# EAGLE design lamloei_node32s3wroom_cp2102_msmd_4layers (EAGLE 7.7.0)
CNAME: LamLoei Node32S3Wroom; CREVISION: R1; DESIGNER: lamloei co.,ltd.
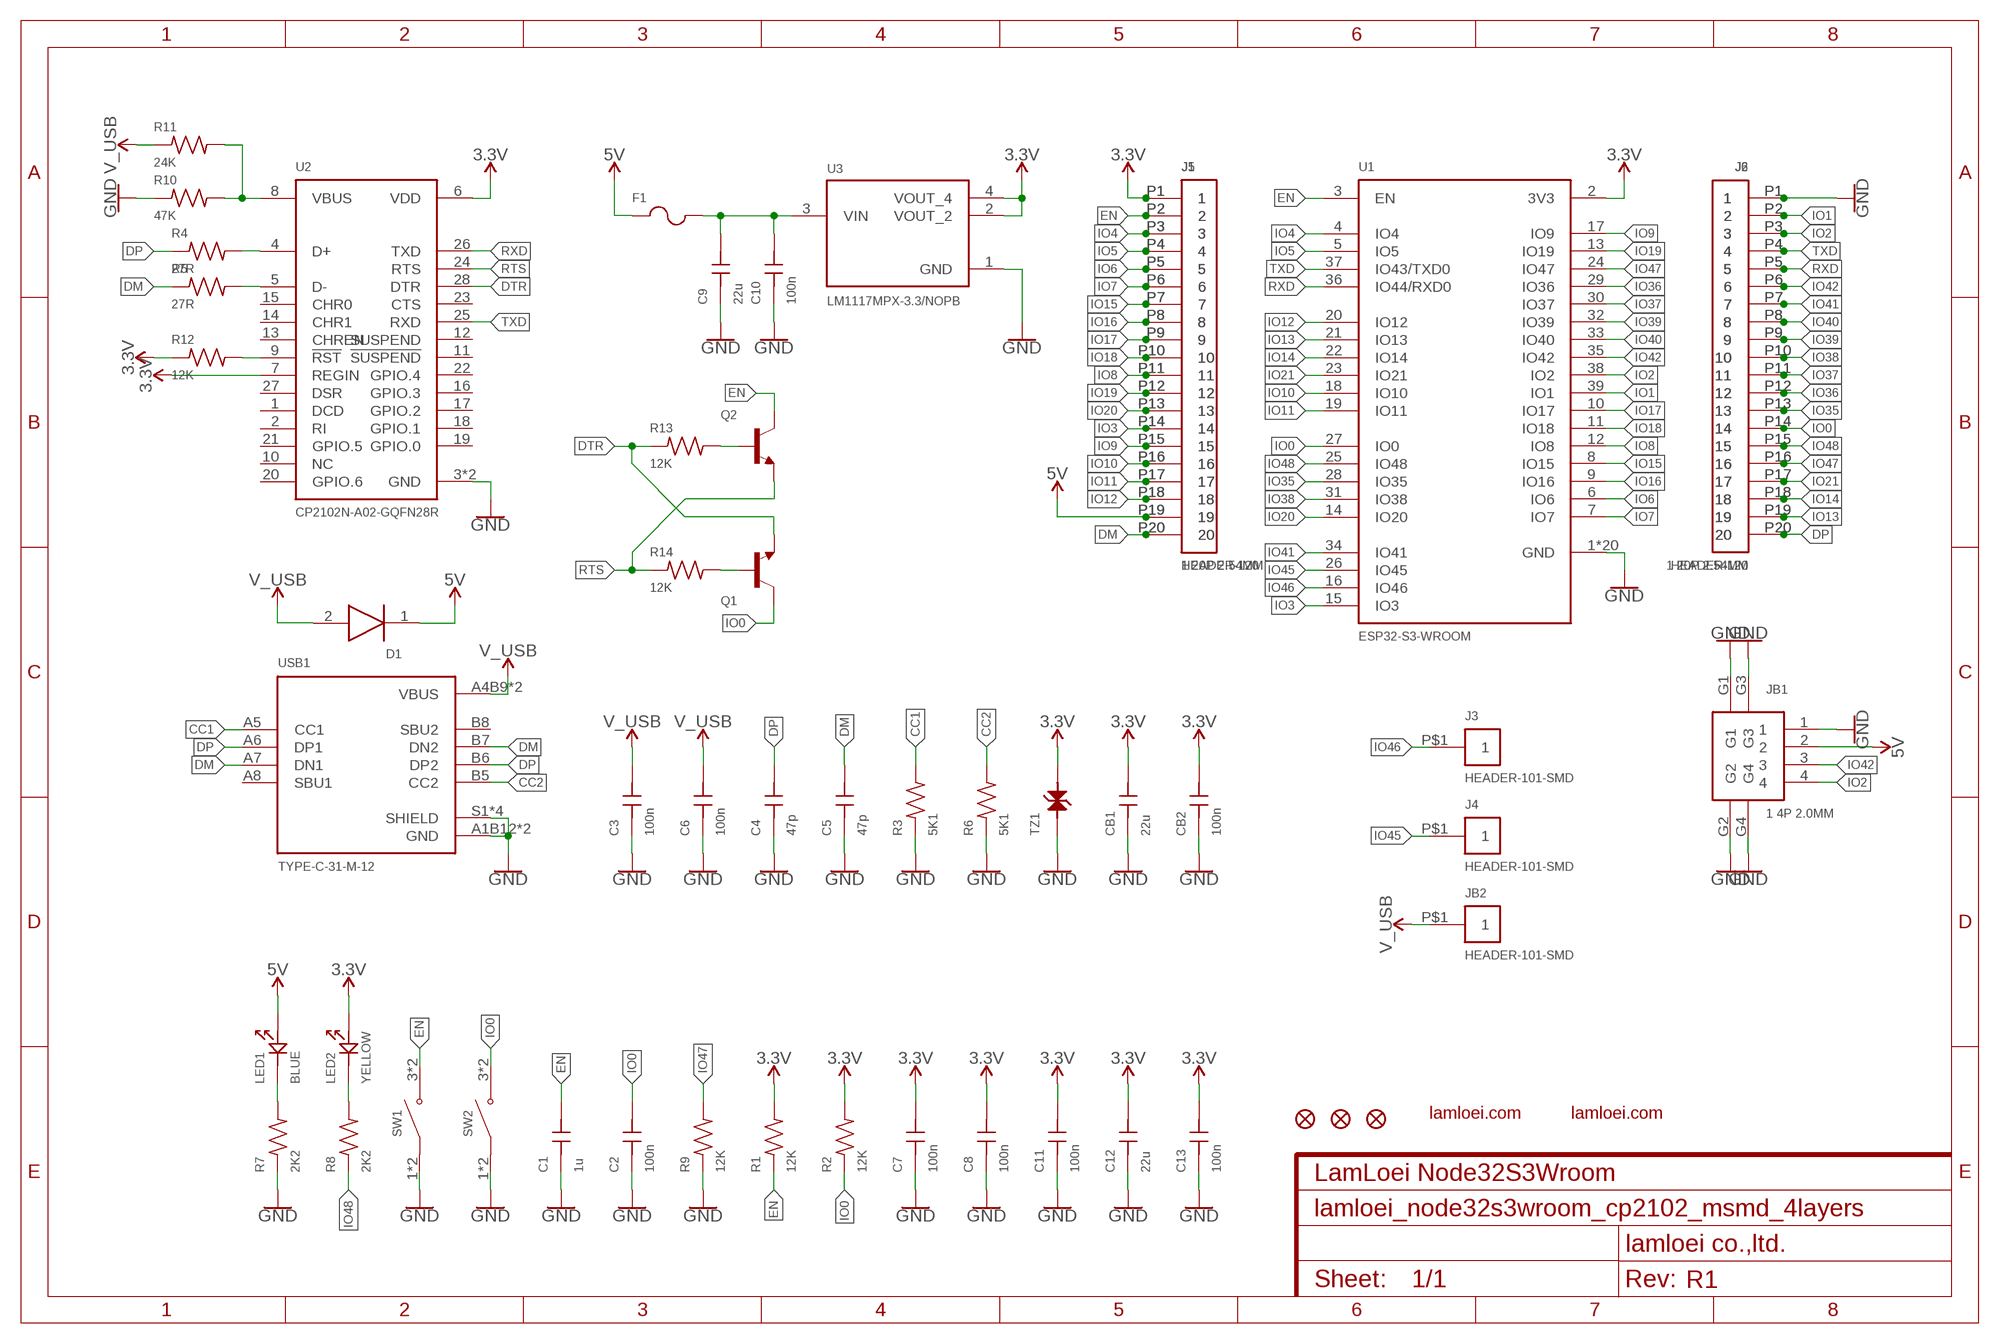
[diagram p0: schematic, sheet 1]

## Parts
C1  1u  GRM155R70J105KA12D  [GRM155R70J105KA12D]
C2  100n  GCM155R71H104KE02D  [GCM155R71H104KE02D]
C3  100n  GCM155R71H104KE02D  [GCM155R71H104KE02D]
C4  47p  GCM1555C1H470JA16D  [GCM1555C1H470JA16D]
C5  47p  GCM1555C1H470JA16D  [GCM1555C1H470JA16D]
C6  100n  GCM155R71H104KE02D  [GCM155R71H104KE02D]
C7  100n  GCM155R71H104KE02D  [GCM155R71H104KE02D]
C8  100n  GCM155R71H104KE02D  [GCM155R71H104KE02D]
C9  22u  GCM21BR71H105KA03L  [GCM21BR71H105KA03L]
C10  100n  GCM155R71H104KE02D  [GCM155R71H104KE02D]
C11  100n  GCM155R71H104KE02D  [GCM155R71H104KE02D]
C12  22u  GCM21BR71H105KA03L  [GCM21BR71H105KA03L]
C13  100n  GCM155R71H104KE02D  [GCM155R71H104KE02D]
CB1  22u  GCM21BR71H105KA03L  [GCM21BR71H105KA03L]
CB2  100n  GCM155R71H104KE02D  [GCM155R71H104KE02D]
D1  PMEG4050EP,115  [PMEG4050EP,115]
F1  MF-NSMF050-2  [MF-NSMF050-2]
J1  1 20P 2.54MM  HEADER-120  [HEADER-120]
J2  1 20P 2.54MM  HEADER-120  [HEADER-120]
J3  HEADER-101-SMD  [HEADER-101-SMD]
J4  HEADER-101-SMD  [HEADER-101-SMD]
J5  HEADER-120  [HEADER-120]
J6  HEADER-120  [HEADER-120]
JB1  1 4P 2.0MM  A2012WR-S-4P  [A2012WR-S-4P]
JB2  HEADER-101-SMD  [HEADER-101-SMD]
LED1  BLUE  19-217BHC-ZL1M2RY3T  [19-217BHC-ZL1M2RY3T]
LED2  YELLOW  19-213/Y2C-CQ2R2L/3T(CY)  [19-213/Y2C-CQ2R2L/3T(CY)]
Q1  BC847B,215  [BC847B,215]
Q2  BC847B,215  [BC847B,215]
R1  12K  RC0402FR-0712KL  [R0402]
R2  12K  RC0402FR-0712KL  [R0402]
R3  5K1  RC0402FR-075K1L  [R0402]
R4  27R  RC0402FR-0727RL  [R0402]
R5  27R  RC0402FR-0727RL  [R0402]
R6  5K1  RC0402FR-075K1L  [R0402]
R7  2K2  RC0402FR-072K2L  [R0402]
R8  2K2  RC0402FR-072K2L  [R0402]
R9  12K  RC0402FR-0712KL  [R0402]
R10  47K  RC0402FR-0747KL  [R0402]
R11  24K  RC0402FR-0724KL  [R0402]
R12  12K  RC0402FR-0712KL  [R0402]
R13  12K  RC0402FR-0712KL  [R0402]
R14  12K  RC0402FR-0712KL  [R0402]
SW1  K2-1808SN-A4SW-01  [K2-1808SN-A4SW-01]
SW2  K2-1808SN-A4SW-01  [K2-1808SN-A4SW-01]
TZ1  LXES15AAA1-153  [LXES15AAA1-153]
U1  ESP32-S3-WROOM  [ESP32-S3-WROOM]
U2  CP2102N-A02-GQFN28R  [CP2102N-A02-GQFN28R]
U3  LM1117MPX-3.3/NOPB  [LM1117MPX-3.3/NOPB]
USB1  TYPE-C-31-M-12  [TYPE-C-31-M-12]
ZFD1  FIDUCIAL1X2  [FIDUCIAL-1X2]
ZFD2  FIDUCIAL1X2  [FIDUCIAL-1X2]
ZFD3  FIDUCIAL1X2  [FIDUCIAL-1X2]
ZL1  LAMLEOI_LOGO_3  [LAMLEOI_LOGO_3]
ZL2  LAMLEOI_LOGO_3  [LAMLEOI_LOGO_3]

## Nets
3.3V: C7.2 C8.2 C11.2 C12.2 C13.2 CB1.2 CB2.2 J1.P1 J5.P1 LED2.2 R1.2 R2.2 R12.1 TZ1.2 U1.2(3V3) U2.6(VDD) U2.7(REGIN) U3.2(VOUT_2) U3.4(VOUT_4)
5V: D1.1(K) F1.1 J1.P19 J5.P19 JB1.2 LED1.2
CC1: R3.2 USB1.A5(CC1)
CC2: R6.2 USB1.B5(CC2)
DM: C5.2 J1.P20 J5.P20 R5.1 USB1.A7(DN1) USB1.B7(DN2)
DP: C4.2 J2.P20 J6.P20 R4.1 USB1.A6(DP1) USB1.B6(DP2)
DTR: Q1.E R13.1 U2.28(DTR)
EN: C1.2 J1.P2 J5.P2 Q2.C R1.1 SW1.3(NO) SW1.4(NO) U1.3(EN)
GND: C1.1 C2.1 C3.1 C4.1 C5.1 C6.1 C7.1 C8.1 C9.1 C10.1 C11.1 C12.1 C13.1 CB1.1 CB2.1 J2.P1 J6.P1 JB1.1 JB1.G1 JB1.G2 JB1.G3 JB1.G4 R3.1 R6.1 R7.1 R9.1 R10.1 SW1.1(COM) SW1.2(COM) SW2.1(COM) SW2.2(COM) TZ1.1 U1.1(GND) U1.1.1(GND) U1.1.2(GND) U1.1.3(GND) U1.1.4(GND) U1.1.5(GND) U1.1.6(GND) U1.1.7(GND) U1.1.8(GND) U1.1.9(GND) U1.1.10(GND) U1.1.11(GND) U1.1.12(GND) U1.1.13(GND) U1.1.14(GND) U1.1.15(GND) U1.1.16(GND) U1.1.17(GND) U1.1.18(GND) U1.40(GND) U2.3(GND) U2.29(GND) U3.1(GND) USB1.A1B12(GND) USB1.B1A12(GND) USB1.S1(SHIELD) USB1.S2(SHIELD) USB1.S3(SHIELD) USB1.S4(SHIELD)
IO0: C2.2 J2.P14 J6.P14 Q1.C R2.1 SW2.3(NO) SW2.4(NO) U1.27(IO0)
IO1: J2.P2 J6.P2 U1.39(IO1)
IO2: J2.P3 J6.P3 JB1.4 U1.38(IO2)
IO3: J1.P14 J5.P14 U1.15(IO3)
IO4: J1.P3 J5.P3 U1.4(IO4)
IO5: J1.P4 J5.P4 U1.5(IO5)
IO6: J1.P5 J5.P5 U1.6(IO6)
IO7: J1.P6 J5.P6 U1.7(IO7)
IO8: J1.P11 J5.P11 U1.12(IO8)
IO9: J1.P15 J5.P15 U1.17(IO9)
IO10: J1.P16 J5.P16 U1.18(IO10)
IO11: J1.P17 J5.P17 U1.19(IO11)
IO12: J1.P18 J5.P18 U1.20(IO12)
IO13: J2.P19 J6.P19 U1.21(IO13)
IO14: J2.P18 J6.P18 U1.22(IO14)
IO15: J1.P7 J5.P7 U1.8(IO15)
IO16: J1.P8 J5.P8 U1.9(IO16)
IO17: J1.P9 J5.P9 U1.10(IO17)
IO18: J1.P10 J5.P10 U1.11(IO18)
IO19: J1.P12 J5.P12 U1.13(IO19)
IO20: J1.P13 J5.P13 U1.14(IO20)
IO21: J2.P17 J6.P17 U1.23(IO21)
IO35: J2.P13 J6.P13 U1.28(IO35)
IO36: J2.P12 J6.P12 U1.29(IO36)
IO37: J2.P11 J6.P11 U1.30(IO37)
IO38: J2.P10 J6.P10 U1.31(IO38)
IO39: J2.P9 J6.P9 U1.32(IO39)
IO40: J2.P8 J6.P8 U1.33(IO40)
IO41: J2.P7 J6.P7 U1.34(IO41)
IO42: J2.P6 J6.P6 JB1.3 U1.35(IO42)
IO45: J4.P$1 U1.26(IO45)
IO46: J3.P$1 U1.16(IO46)
IO47: J2.P16 J6.P16 R9.2 U1.24(IO47)
IO48: J2.P15 J6.P15 R8.1 U1.25(IO48)
N$1: R5.2 U2.5(D-)
N$2: R4.2 U2.4(D+)
N$3: C9.2 C10.2 F1.2 U3.3(VIN)
N$4: LED1.1 R7.2
N$5: LED2.1 R8.2
N$6: Q2.B R13.2
N$7: Q1.B R14.2
N$8: R12.2 U2.9(!RST)
N$10: R10.2 R11.2 U2.8(VBUS)
RTS: Q2.E R14.1 U2.24(RTS)
RXD: J2.P5 J6.P5 U1.36(IO44/RXD0) U2.26(TXD)
TXD: J2.P4 J6.P4 U1.37(IO43/TXD0) U2.25(RXD)
V_USB: C3.2 C6.2 D1.2(A) JB2.P$1 R11.1 USB1.A4B9(VBUS) USB1.B4A9(VBUS)
Unconnected: U2.1(DCD) U2.2(RI) U2.10(NC) U2.11(!SUSPEND) U2.12(SUSPEND) U2.13(CHREN) U2.14(CHR1) U2.15(CHR0) U2.16(GPIO.3) U2.17(GPIO.2) U2.18(GPIO.1) U2.19(GPIO.0) U2.20(GPIO.6) U2.22(GPIO.4) U2.23(CTS) U2.27(DSR) USB1.A8(SBU1) USB1.B8(SBU2)

## Power pins joined to a net without a drawn wire
GPIO.5: U2.21(GPIO.5)

## Library data of the parts
C1 = lamloei_e77_GRM155R70J105KA12D:GRM155R70J105KA12D; MANUFACTURER_PART_NUMBER: GRM155R70J105KA12D; VENDOR: Murata
C2 C3 C6-C8 C10 C11 C13 CB2 = lamloei_e77_GCM155R71H104KE02D:GCM155R71H104KE02D; MANUFACTURER_PART_NUMBER: GCM155R71H104KE02D; VENDOR: Murata
C4 C5 = lamloei_e77_GCM1555C1H470JA16D:GCM1555C1H470JA16D; MANUFACTURER_PART_NUMBER: GCM1555C1H470JA16D; VENDOR: Murata
C9 C12 CB1 = lamloei_e77_GCM21BR71H105KA03L:GCM21BR71H105KA03L; MANUFACTURER_PART_NUMBER: GCM21BR71H105KA03L; VENDOR: Murata
D1 = lamloei_e77_PMEG4050EP_115:PMEG4050EP,115: Nexperia PMEG4050EP,115 SMT Schottky Diode, 40V 5A, 2-Pin SOD-128 Source: Datasheet <http://uk.rs-online.com/web/p/products/7805405P>; DESCRIPTION: Nexperia PMEG4050EP,115 SMT Schottky Diode, 40V 5A, 2-Pin SOD-128; HEIGHT: 1.1mm; MANUFACTURER_NAME: Nexperia; MANUFACTURER_PART_NUMBER: PMEG4050EP,115; RS_PART_NUMBER: 7805405P; RS_PRICE-STOCK: http://uk.rs-online.com/web/p/products/7805405P
F1 = lamloei_e77_mf-nsmf050-2-noretrict:MF-NSMF050-2; DATASHEET: https://datasheet.lcsc.com/lcsc/1809212037_BOURNS-MF-NSMF050-2_C75464.pdf; DESCRIPTIONS: 13.2V 1A 1206 PTC Resettable Fuses; LCSC_PART: C75464; MANUFACTURER: BOURNS; MANUFACTURER_PART_NUMBER: MF-NSMF050-2; OPERATION_TEMPERATURE: -40°C ~ +85°C; OPERATION_TEMPERATURE_HIGH: +85°C; OPERATION_TEMPERATURE_LOW: -40°C; PACKAGE: 1206; PCBA_COST: Extended
J1 = lamloei_e77_HEADER-120A:HEADER-120
J2 = lamloei_e77_HEADER-120B:HEADER-120
J3 J4 JB2 = lamloei_e77_HEADER-101-SMD:HEADER-101-SMD
J5 J6 = lamloei_e77_HEADER-120D:HEADER-120
JB1 = lamloei_e77_a2012wr-s-4p:A2012WR-S-4P
LED1 = lamloei_e77_19-217BHC-ZL1M2RY3T:19-217BHC-ZL1M2RY3T; MANUFACTURER_PART_NUMBER: 19-217BHC-ZL1M2RY3T; VENDOR: Everlight Elec
LED2 = lamloei_e77_19-213Y2C-CQ2R2L3T(CY):19-213/Y2C-CQ2R2L/3T(CY); MANUFACTURER_PART_NUMBER: 19-213/Y2C-CQ2R2L/3T(CY); VENDOR: Everlight Elec
Q1 Q2 = lamloei_e77_bc847b_215:BC847B,215; AVAILABILITY: In Stock; DESCRIPTION: Bipolar (BJT) Transistor NPN 45V 100mA 100MHz 300mW Surface Mount SOT-23-3 (TO-236); MF: ON Semiconductor; MP: BC847BLT3G; PACKAGE: SOT-23-3 ON Semiconductor; PRICE: None
R1 R2 R9 R12-R14 = lamloei_e77_rc0402fr-0712kl:RC0402FR-0712KL; DATASHEET: https://datasheet.lcsc.com/lcsc/1811081726_YAGEO-RC0402FR-0712KL_C114760.pdf; DESCRIPTIONS: 12kΩ ±1% 0.0625W ±100ppm/°C; DIELECTRIC: X7R; LCSC_PART: C114760; MANUFACTURER: YAGEO; MANUFACTURER_PART_NUMBER: RC0402FR-0712KL; OPERATION_POWER: 1/16W; OPERATION_TEMPERATURE: -55°C ~ +155°C; OPERATION_TEMPERATURE_HIGH: +155°C; OPERATION_TEMPERATURE_LOW: -55°C; PACKAGE: 0402; PCBA_COST: EXTENDED; RATED_VOLTAGE: 100VDC; RESISTANCE: 12kΩ; TOLERANCE: ±1%
R3 R6 = lamloei_e77_rc0402fr-075k1l:RC0402FR-075K1L; DATASHEET: https://datasheet.lcsc.com/lcsc/1809201112_YAGEO-RC0402FR-075K1L_C105872.pdf; DESCRIPTIONS: 5.1kΩ ±1% 0.0625W ±100ppm/°C; DIELECTRIC: X7R; LCSC_PART: C105872; MANUFACTURER: YAGEO; MANUFACTURER_PART_NUMBER: RC0402FR-075K1L; OPERATION_POWER: 1/16W; OPERATION_TEMPERATURE: -55°C ~ +155°C; OPERATION_TEMPERATURE_HIGH: +155°C; OPERATION_TEMPERATURE_LOW: -55°C; PACKAGE: 0402; PCBA_COST: EXTENDED; RATED_VOLTAGE: 100VDC; RESISTANCE: 5.1kΩ; TOLERANCE: ±1%
R4 R5 = lamloei_e77_rc0402fr-0727rl:RC0402FR-0727RL; DATASHEET: https://datasheet.lcsc.com/lcsc/1810241334_YAGEO-RC0402FR-0727RL_C138021.pdf; DESCRIPTIONS: 27Ω ±1% 0.0625W ±100ppm/°C; DIELECTRIC: X7R; LCSC_PART: C138021; MANUFACTURER: YAGEO; MANUFACTURER_PART_NUMBER: RC0402FR-0727RL; OPERATION_POWER: 1/16W; OPERATION_TEMPERATURE: -55°C ~ +155°C; OPERATION_TEMPERATURE_HIGH: +155°C; OPERATION_TEMPERATURE_LOW: -55°C; PACKAGE: 0402; PCBA_COST: EXTENDED; RATED_VOLTAGE: 100VDC; RESISTANCE: 27Ω; TOLERANCE: ±1%
R7 R8 = lamloei_e77_rc0402fr-072k2l:RC0402FR-072K2L; DATASHEET: https://datasheet.lcsc.com/lcsc/1809201112_YAGEO-RC0402FR-072K2L_C114762.pdf; DESCRIPTIONS: 2.2kΩ ±1% 0.0625W ±100ppm/°C; DIELECTRIC: X7R; LCSC_PART: C114762; MANUFACTURER: YAGEO; MANUFACTURER_PART_NUMBER: RC0402FR-072K2L; OPERATION_POWER: 1/16W; OPERATION_TEMPERATURE: -55°C ~ +155°C; OPERATION_TEMPERATURE_HIGH: +155°C; OPERATION_TEMPERATURE_LOW: -55°C; PACKAGE: 0402; PCBA_COST: EXTENDED; RATED_VOLTAGE: 100VDC; RESISTANCE: 2.2kΩ; TOLERANCE: ±1%
R10 = lamloei_e77_rc0402fr-0747kl:RC0402FR-0747KL; DATASHEET: https://datasheet.lcsc.com/lcsc/1811011510_YAGEO-RC0402FR-0747KL_C93943.pdf; DESCRIPTIONS: 47kΩ ±1% 0.0625W ±100ppm/°C; DIELECTRIC: X7R; LCSC_PART: C93943; MANUFACTURER: YAGEO; MANUFACTURER_PART_NUMBER: RC0402FR-0747KL; OPERATION_POWER: 1/16W; OPERATION_TEMPERATURE: -55°C ~ +155°C; OPERATION_TEMPERATURE_HIGH: +155°C; OPERATION_TEMPERATURE_LOW: -55°C; PACKAGE: 0402; PCBA_COST: EXTENDED; RATED_VOLTAGE: 100VDC; RESISTANCE: 47kΩ; TOLERANCE: ±1%
R11 = lamloei_e77_rc0402fr-0724kl:RC0402FR-0724KL; DATASHEET: https://datasheet.lcsc.com/lcsc/1810241334_YAGEO-RC0402FR-0724KL_C138026.pdf; DESCRIPTIONS: 24kΩ ±1% 0.0625W ±100ppm/°C; DIELECTRIC: X7R; LCSC_PART: C138026; MANUFACTURER: YAGEO; MANUFACTURER_PART_NUMBER: RC0402FR-0724KL; OPERATION_POWER: 1/16W; OPERATION_TEMPERATURE: -55°C ~ +155°C; OPERATION_TEMPERATURE_HIGH: +155°C; OPERATION_TEMPERATURE_LOW: -55°C; PACKAGE: 0402; PCBA_COST: EXTENDED; RATED_VOLTAGE: 100VDC; RESISTANCE: 24kΩ; TOLERANCE: ±1%
SW1 SW2 = lamloei_e77_K2-1808SN-A4SW-01:K2-1808SN-A4SW-01: Check prices <https://pricing.snapeda.com/parts/4-1437565-2/TE%20Connectivity/view-part?ref=eda>; AVAILABILITY: In Stock; COMMENT: 4-1437565-2; CONFIGURATION_POLE-THROW: Single Pole - Single Throw; CONTACT_CURRENT_RATING: 50 mA; DESCRIPTION: Tactile Switch SPST-NO Top Actuated Surface Mount; EU_ROHS_COMPLIANCE: Compliant; MF: TE Connectivity; MP: 4-1437565-2; PACKAGE: None; PRICE: None
TZ1 = lamloei_e77_lxes15aaa1-153:LXES15AAA1-153; DATASHEET: https://datasheet.lcsc.com/lcsc/1811081617_Murata-Electronics-LXES15AAA1-153_C86141.pdf; DESCRIPTIONS: Bidirectional 4V 0402 Diodes - ESD; LCSC_PART: C86141; MANUFACTURER: Murata; MANUFACTURER_PART_NUMBER: LXES15AAA1-153; OPERATION_TEMPERATURE: -40°C ~ +85°C; OPERATION_TEMPERATURE_HIGH: +85°C; OPERATION_TEMPERATURE_LOW: -40°C; PACKAGE: 0402; PCBA_COST: EXTENDED; RATED_VOLTAGE: 4V
U1 = lamloei_e77_ESP32-S3-WROOM-ANT:ESP32-S3-WROOM: Module: combo; GPIO, I2C x2, I2S x2, SDIO, SPI x3, UART x3; 19.5dBm; AVAILABILITY: Warning; DESCRIPTION: Module: combo; GPIO, I2C x2, I2S x2, SDIO, SPI x3, UART x3; 19.5dBm; MF: Olimex LTD; MP: ESP-WROOM-32; PACKAGE: Module Espressif Systems; PRICE: 4.57 USD
U2 = lamloei_e77_cp2102n-a02-gqfn24r:CP2102N-A02-GQFN28R
U3 = lamloei_e77_LM1117MPX-3.3_NOPB:LM1117MPX-3.3/NOPB: 800-mA 15-V linear voltage regulator 4-SOT-223 0 to 125 Check prices <https://pricing.snapeda.com/parts/LM1117MPX-3.3/NOPB/Texas%20Instruments/view-part?ref=eda>; AVAILABILITY: In Stock; DESCRIPTION: 800-mA 15-V linear voltage regulator 4-SOT-223 0 to 125; MF: Texas Instruments; MP: LM1117MPX-3.3/NOPB; PACKAGE: SOT-223-4 Texas Instruments; PRICE: None; PURCHASE-URL: https://pricing.snapeda.com/search/part/LM1117MPX-3.3/NOPB/?ref=eda
USB1 = _lamloei_e77_TYPE-C-31-M-12:TYPE-C-31-M-12; AVAILABILITY: Unavailable; DESCRIPTION: USB Connectors 24 Receptacle 1 8.94*7.3mm RoHS; DIFFX: 1.75; DIFFY: -3.53; MF: HRO Electronics Co., Ltd.; MP: TYPE-C-31-M-12; PACKAGE: Package; PRICE: None
ZFD1-ZFD3 = SparkFun-Aesthetics:FIDUCIAL: Fiducial Alignment Points Point-of-reference for pick-and-place machines and other optical instruments.
ZL1 ZL2 = lamloei_logo_3:LAMLEOI_LOGO_3: lamloei

## Board
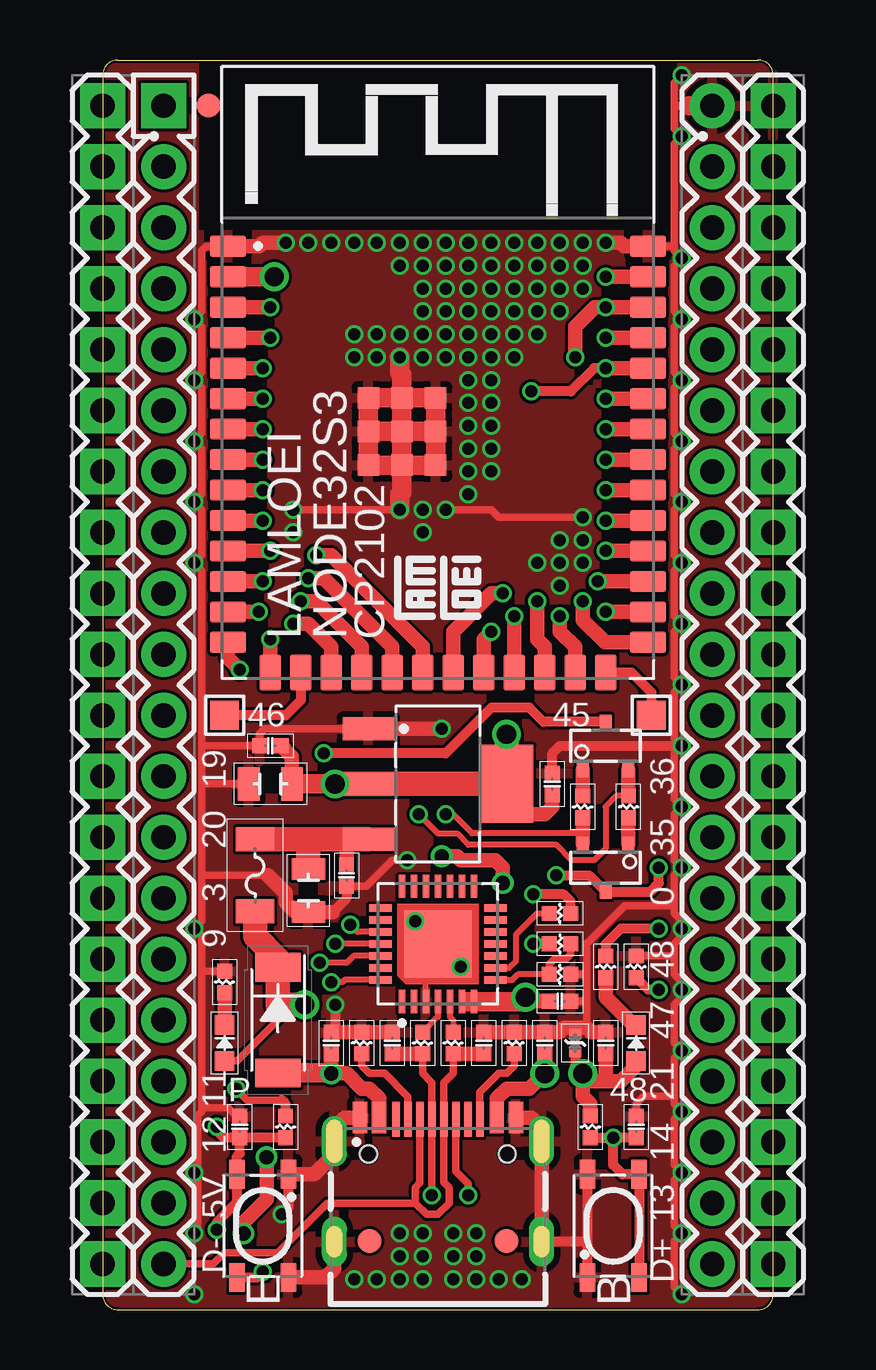
[diagram p1: board, top side]
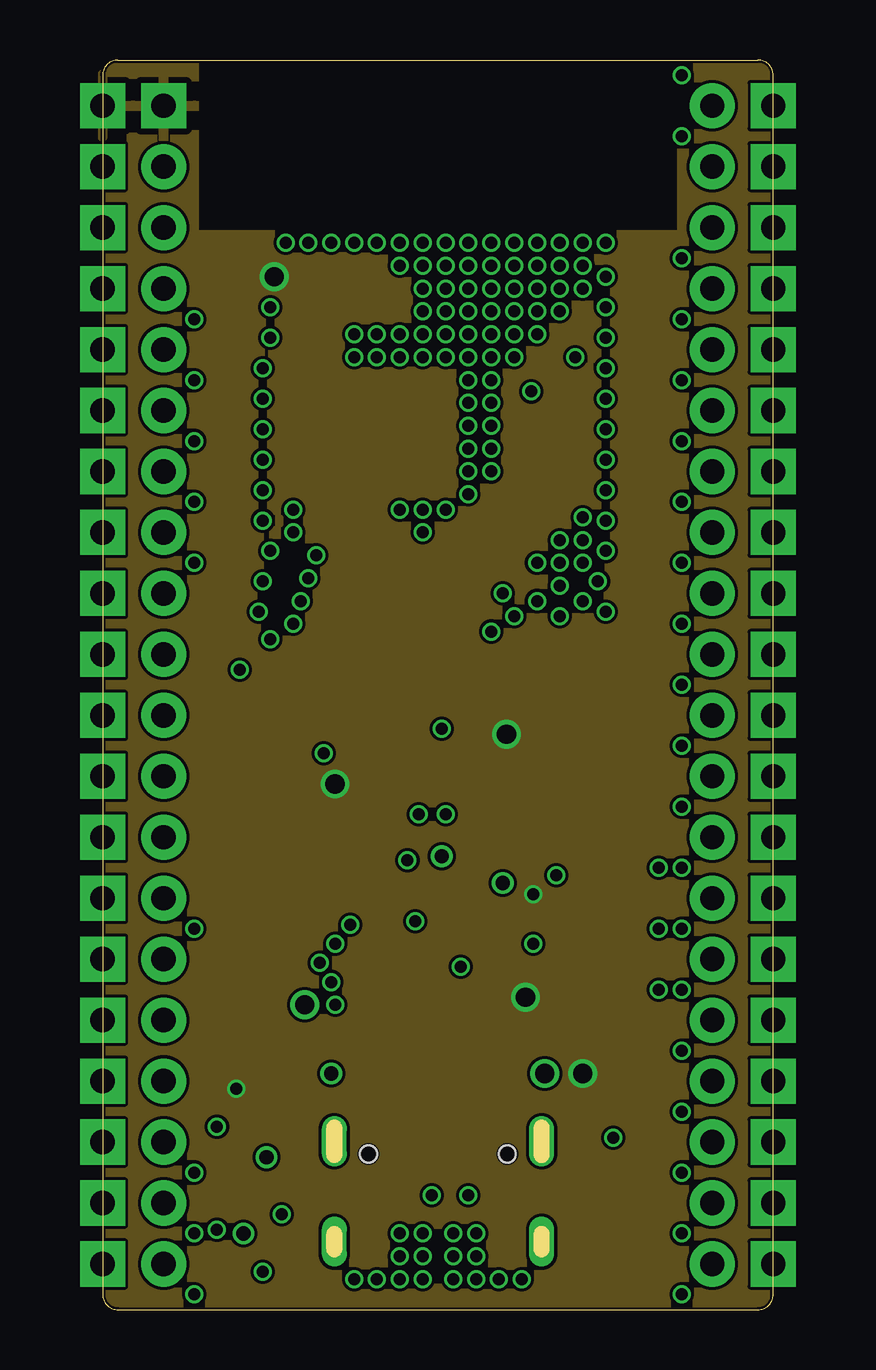
[diagram p2: board, inner layer Route2]
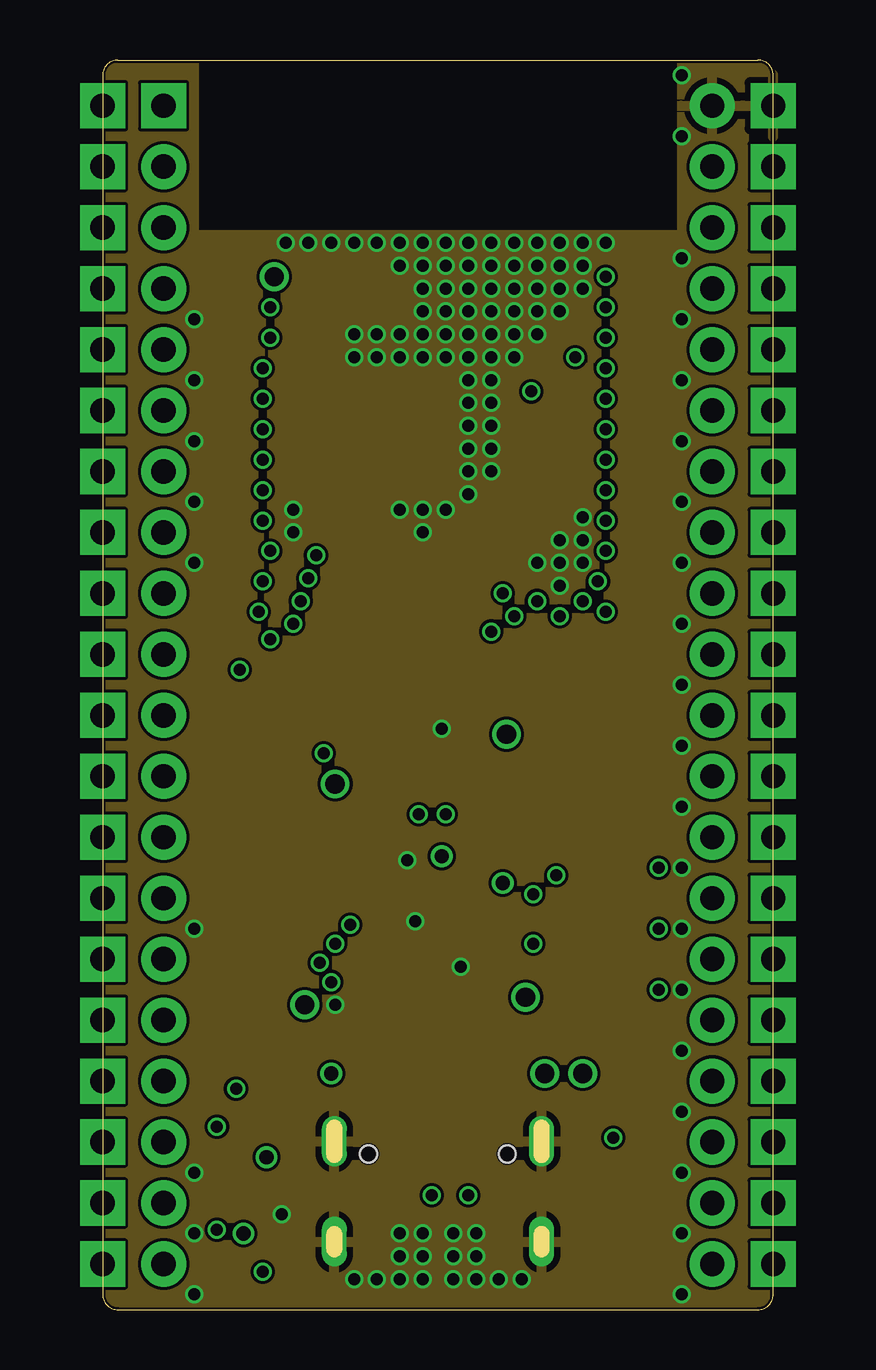
[diagram p3: board, inner layer Route15]
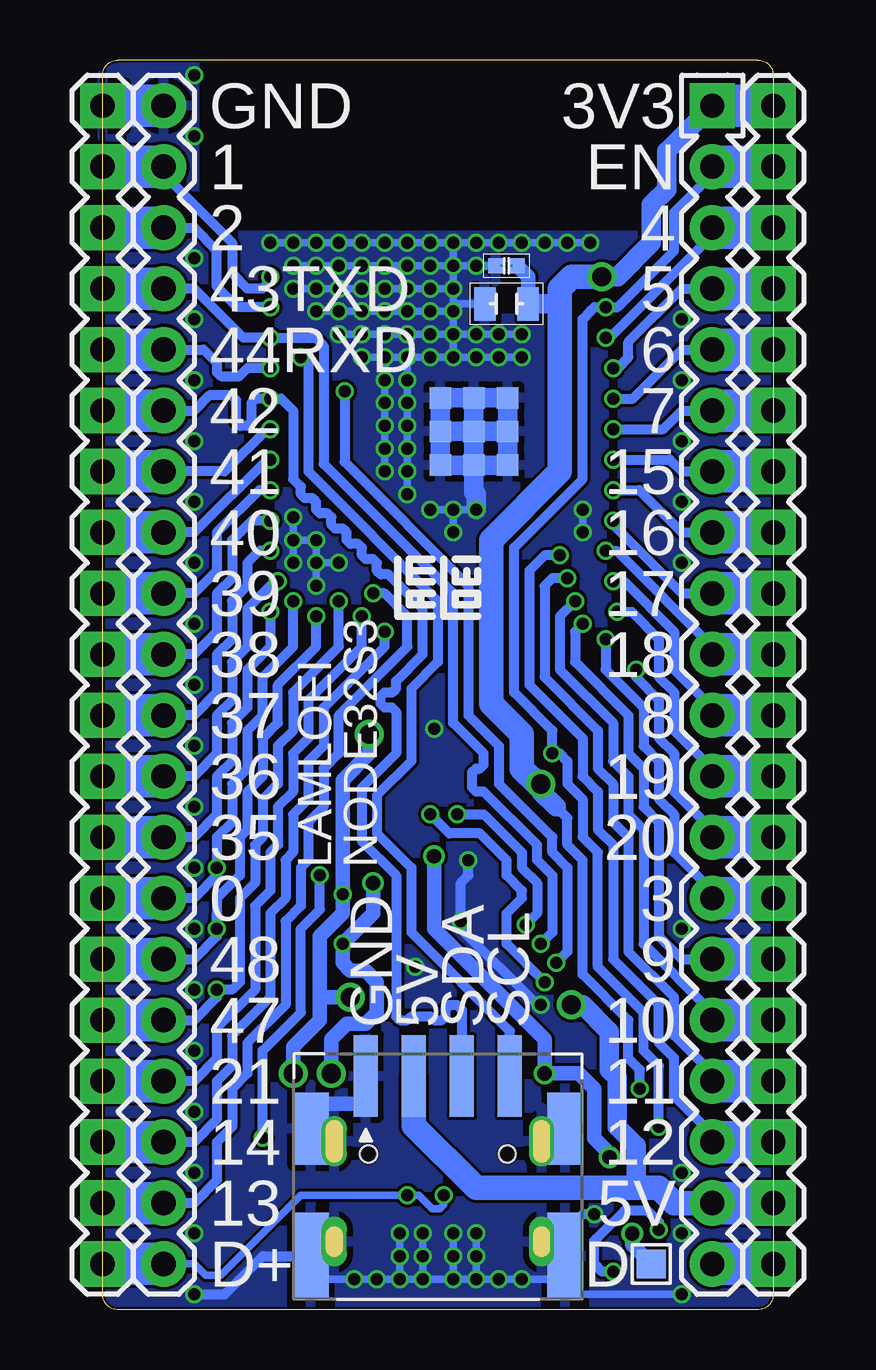
[diagram p4: board, bottom side, seen from below]

Size 27.94 x 52.07 mm. Coordinates in mm from the lower left corner, seen from the top.
Outline: 27.31,0 arc90 27.94,0.64 27.94,51.44 arc90 27.31,52.07 0.64,52.07 arc90 0,51.44 0,0.64 arc90 0.64,0 27.31,0
Copper layers (1*2*15*16): Top 0.035559375mm / dielectric 0.17018125mm / Route2 0.01778125mm / dielectric 47mil / Route15 0.01778125mm / dielectric 0.17018125mm / Bottom 0.035559375mm
Design rules "jlcpcb-4-layer": minimum track width 5mil, minimum drill 0.2mm, track to track 0.126490625mm, track to pad 0.126490625mm, pad to pad 0.126490625mm, via to via 0.126490625mm, smd to smd 0mil, copper to edge 0.1mm, drill to drill 5mil, minimum pad ring 4mil, minimum via ring 4mil, stop-mask expansion 3mil, vias tented up to drill 100mil, thermal gap 10mil

### Footprints (pad centres in the part's own frame; a part is rotated, then mirrored left to right if it is on the bottom)
GRM155R70J105KA12D = smd 0.62 x 0.62: 1 -0.45,0; 2 0.45,0
GCM155R71H104KE02D = smd 0.62 x 0.62: 1 -0.45,0; 2 0.45,0
GCM1555C1H470JA16D = smd 0.62 x 0.62: 1 -0.45,0; 2 0.45,0
GCM21BR71H105KA03L = smd 0.9 x 1.4: 1 -0.9,0; 2 0.9,0
PMEG4050EP,115 = smd 1.2 x 1.9: 1 -2.2,0; 2 2.2,0
MF-NSMF050-2 = smd 1 x 1.6: 1 -1.5,0; 2 1.5,0
HEADER-120 = drill 1.016 pad 1.88 square: P1 24.13,0 | drill 1.016 pad 1.88: P2 21.59,0; P3 19.05,0; P4 16.51,0; P5 13.97,0; P6 11.43,0; P7 8.89,0; P8 6.35,0; P9 3.81,0; P10 1.27,0; P11 -1.27,0; P12 -3.81,0; P13 -6.35,0; P14 -8.89,0; P15 -11.43,0; P16 -13.97,0; P17 -16.51,0; P18 -19.05,0; P19 -21.59,0; P20 -24.13,0
HEADER-120' = drill 1.016 pad 1.88: P1 24.13,0; P2 21.59,0; P3 19.05,0; P4 16.51,0; P5 13.97,0; P6 11.43,0; P7 8.89,0; P8 6.35,0; P9 3.81,0; P10 1.27,0; P11 -1.27,0; P12 -3.81,0; P13 -6.35,0; P14 -8.89,0; P15 -11.43,0; P16 -13.97,0; P17 -16.51,0; P18 -19.05,0; P19 -21.59,0; P20 -24.13,0
HEADER-101-SMD = smd 1.2 x 1.2: P$1 0,0
HEADER-120'' = drill 1.016 pad 1.88 square: P1 24.13,0; P2 21.59,0; P3 19.05,0; P4 16.51,0; P5 13.97,0; P6 11.43,0; P7 8.89,0; P8 6.35,0; P9 3.81,0; P10 1.27,0; P11 -1.27,0; P12 -3.81,0; P13 -6.35,0; P14 -8.89,0; P15 -11.43,0; P16 -13.97,0; P17 -16.51,0; P18 -19.05,0; P19 -21.59,0; P20 -24.13,0
A2012WR-S-4P = smd 1 x 3.4: 1 -3,3.7; 2 -1,3.7; 3 1,3.7; 4 3,3.7 | smd 1.5 x 3.6: G1 -5.3,-3.8; G2 5.3,-3.8 | smd 1.5 x 3: G3 -5.3,1.5; G4 5.3,1.5
19-217BHC-ZL1M2RY3T = smd 0.8 x 0.8: 1 -0.75,0; 2 0.75,0
19-213/Y2C-CQ2R2L/3T(CY) = smd 0.8 x 0.8: 1 -0.75,0; 2 0.75,0
BC847B,215 = smd 0.6 x 0.5: B 1,-0.95; C -1,0; E 1,0.95
R0402 = smd 0.62 x 0.62: 1 -0.45,0; 2 0.45,0
K2-1808SN-A4SW-01 = smd 1.2 x 0.65: 1 -2.15,1.075; 2 2.15,1.075; 3 -2.15,-1.075; 4 2.15,-1.075
LXES15AAA1-153 = smd 0.4 x 0.5: 1 -0.4,0; 2 0.4,0
ESP32-S3-WROOM = smd 0.9 x 1.5: 1 -5.26,-8.75; 2 -3.99,-8.75; 3 -2.72,-8.75; 4 -1.45,-8.75; 5 -0.18,-8.75; 6 1.09,-8.75; 7 2.36,-8.75; 8 3.63,-8.75; 9 4.9,-8.75; 10 6.17,-8.75; 11 7.44,-8.75; 12 8.71,-8.75; 13 9.98,-8.75; 14 11.25,-8.75; 27 11.25,8.75; 28 9.98,8.75; 29 8.71,8.75; 30 7.44,8.75; 31 6.17,8.75; 32 4.9,8.75; 33 3.63,8.75; 34 2.36,8.75; 35 1.09,8.75; 36 -0.18,8.75; 37 -1.45,8.75; 38 -2.72,8.75; 39 -3.99,8.75; 40 -5.26,8.75 | smd 0.9 x 0.9: 1.1 1.06,-2.9; 1.2 1.06,-1.5; 1.3 1.06,-0.1; 1.4 2.46,-2.9; 1.5 2.46,-1.5; 1.6 2.46,-0.1; 1.7 3.86,-2.9; 1.8 3.86,-1.5; 1.9 3.86,-0.1 | smd 0.9 x 0.9 bottom: 1.10 1.06,-2.9; 1.11 1.06,-1.5; 1.12 1.06,-0.1; 1.13 2.46,-2.9; 1.14 2.46,-1.5; 1.15 2.46,-0.1; 1.16 3.86,-2.9; 1.17 3.86,-1.5; 1.18 3.86,-0.1 | smd 1.5 x 0.9: 15 12.5,-6.985; 16 12.5,-5.715; 17 12.5,-4.445; 18 12.5,-3.175; 19 12.5,-1.905; 20 12.5,-0.635; 21 12.5,0.635; 22 12.5,1.905; 23 12.5,3.175; 24 12.5,4.445; 25 12.5,5.715; 26 12.5,6.985
CP2102N-A02-GQFN28R = smd 0.95 x 0.29: 1 -2.4,1.5; 2 -2.4,1; 3 -2.4,0.5; 4 -2.4,0; 5 -2.4,-0.5; 6 -2.4,-1; 7 -2.4,-1.5; 15 2.4,-1.5; 16 2.4,-1; 17 2.4,-0.5; 18 2.4,0; 19 2.4,0.5; 20 2.4,1; 21 2.4,1.5 | smd 0.29 x 0.95: 8 -1.5,-2.4; 9 -1,-2.4; 10 -0.5,-2.4; 11 0,-2.4; 12 0.5,-2.4; 13 1,-2.4; 14 1.5,-2.4; 22 1.5,2.4; 23 1,2.4; 24 0.5,2.4; 25 0,2.4; 26 -0.5,2.4; 27 -1,2.4; 28 -1.5,2.4 | smd 2.8 x 2.8: 29 0,0
LM1117MPX-3.3/NOPB = smd 2.15 x 0.95: 1 2.9,-2.3; 2 2.9,0; 3 2.9,2.3 | smd 2.15 x 3.25: 4 -2.9,0
TYPE-C-31-M-12 = smd 0.6 x 1.3: A1B12 3.25,-3.56; A4B9 2.45,-3.56; B1A12 -3.25,-3.56; B4A9 -2.45,-3.56 | smd 0.3 x 1.45: A5 1.25,-3.485; A6 0.25,-3.485; A7 -0.25,-3.485; A8 -1.25,-3.485; B5 -1.75,-3.485; B6 -0.75,-3.485; B7 0.75,-3.485; B8 1.75,-3.485 | drill 0.65 pad 1.05 long: S1 4.32,-2.57; S2 -4.32,-2.57; S3 4.32,1.61; S4 -4.32,1.61 | hole 0.7: 2.89,-2.04; -2.89,-2.04
FIDUCIAL-1X2 = smd 1 x 1: 1 0,0

### Placement (x,y rotation side)
C1  5.71,7.62 270 top
C2  22.23,7.62 270 top
C3  9.53,11.11 270 top
C4  12.06,11.11 270 top
C5  15.88,11.11 270 top
C6  18.42,11.11 270 top
C7  20.96,11.11 270 top
C8  19.05,12.86 180 top
C9  8.57,17.46 90 top
C10  10.16,18.1 90 top
C11  18.73,21.91 270 top
C12  6.98,21.91 0 top
C13  6.98,23.5 0 top
CB1  11.11,41.91 0 bottom
CB2  11.11,43.5 0 bottom
D1  7.3,12.06 270 top
F1  6.35,18.1 90 top
J1  2.54,26.04 90 top
J2  1 20P 2.54MM  [HEADER-120']  25.4,26.04 90 top
J3  5.08,24.77 0 top
J4  22.86,24.77 0 top
J5  HEADER-120  [HEADER-120'']  0,26.04 90 top
J6  HEADER-120  [HEADER-120'']  27.94,26.04 90 top
JB1  13.97,6.03 0 bottom
JB2  5.08,1.91 0 bottom
LED1  5.08,11.11 270 top
LED2  22.23,11.11 270 top
Q1  20.96,18.41 90 top
Q2  20.96,23.5 270 top
R1  7.62,7.62 90 top
R2  20.32,7.62 90 top
R3  10.79,11.11 270 top
R4  13.33,11.11 90 top
R5  14.61,11.11 90 top
R6  17.15,11.11 270 top
R7  5.08,13.65 270 top
R8  20.96,14.29 270 top
R9  22.23,14.29 270 top
R10  19.05,13.97 180 top
R11  19.05,15.24 0 top
R12  19.05,16.51 180 top
R13  20,20.95 90 top
R14  21.91,20.95 270 top
SW1  6.67,3.49 270 top
SW2  21.27,3.49 90 top
TZ1  19.69,11.11 270 top
U1  13.97,39.05 270 top
U2  13.97,15.24 90 top
U3  13.97,21.91 180 top
USB1  13.97,4.45 180 top
ZFD1  4.41,50.16 0 top
ZFD2  11.11,2.86 0 top
ZFD3  16.83,2.86 0 top
ZL1  11.99,28.57 0 top
ZL2  15.95,28.57 0 bottom

### Tracks (layer width: path | path; a pad name or v marks a point on that pad's centre or on a via)
3.3V  (via drill 0.5, 0.8)
  Top 0.254: 12.97,21.91 13.02,21.91 | U2.6 U2.7
  Top 0.305: 7.46,8.73 6.03,8.73 v5.56,9.21
  Top 0.406: TZ1.2 19.69,10.16 v20,9.84 | R1.2 7.62,8.57 7.46,8.73 | R12.1 19.5,17.01 19.21,17.3 v17.94,17.3
  Top 0.61: R2.2 20.32,8.57 20,8.89 v20,9.84 20,9.53 20.96,9.53 | LED2.2 22.23,10.16 21.59,9.53 20.96,9.53 | C7.2 20.96,9.53 | C12.2 7.88,23.05 C13.2 | 16.83,21.46 16.83,22.54 | C11.2 18.73,20.95 18.42,20.64 16.87,20.64 U3.4 | C8.2 17.78,12.86 v17.62,13.02
  Top 0.813: U1.2 v7.14,43.04 | C12.2 v9.68,21.91 | v17.62,13.02 17.44,12.84 U2.7 15.24,12.84
  Top 1.016: v16.83,23.97 16.83,22.54 16.83,21.91 U3.4 13.02,21.91 U3.2 v9.68,21.91
  Bottom 0.406: 9.68,21.59 v9.68,21.91 | 9.05,20.95 8.57,20.48 8.57,19.37 7.94,18.73 7.94,13.97 6.03,12.06 6.03,10.48 5.56,10 v5.56,9.21
  Bottom 0.61: v16.83,23.97 16.83,23.18 17.94,22.07 v17.94,17.3 17.94,16.51 18.89,15.56 18.89,13.02 | CB1.2 10.21,43.05 CB2.2 | v20,9.84 20,10.95 18.89,12.06 18.89,13.02 | 18.89,13.02 v17.62,13.02
  Bottom 0.813: v7.14,43.04 6.49,43.04 5.08,44.45 5.08,46.04 4.45,46.67 4.45,48.26 J1.P1 | CB1.2 8.89,41.91 | 9.05,20.95 9.68,21.59
  Bottom 1.016: v7.14,43.04 8.39,43.04 8.89,42.55 8.89,41.91 8.89,34.92 11.75,32.07 11.75,25.24 10.48,23.97 10.48,22.54 9.84,21.91 v9.68,21.91
  Bottom 1.778: J1.P1 J5.P1
  pour Route2: 0,0 27.94,0 27.94,52.07 24.13,52.07 24.13,44.77 3.81,44.77 3.81,52.07 0,52.07
5V  (via drill 0.8)
  Top 0.305: LED1.2 5.6,10.36 7.3,12.06 7.3,12.7
  Top 1.016: F1.1 6.35,15.56 7.3,14.61 D1.1 7.3,12.7 v8.41,12.7
  Bottom 0.813: 5.71,5.08 5.71,5.24 5.71,6.83 6.51,7.62 6.51,9.68 6.83,10 6.83,11.59 7.94,12.7 v8.41,12.7
  Bottom 1.016: J1.P19 4.13,4.45 4.76,5.08 5.71,5.08 12.38,5.08 14.97,7.67 JB1.2
  Bottom 1.778: J5.P19 J1.P19
CC1
  Top 0.305: USB1.A5 12.72,8.87 11.75,9.84 11.11,9.84 10.79,10.16 R3.2
CC2
  Top 0.305: USB1.B5 15.72,9.05 16.51,9.84 16.83,9.84 17.15,10.16 R6.2
DM
  Top 0.305: R5.1 14.61,9.84 14.22,9.46 USB1.A7 14.22,5.31 14.45,5.08 14.45,4.45 13.97,3.97 13.49,3.97 13.02,4.45 | J1.P20 4.6,1.91 5.08,2.38 7.3,2.38 9.37,4.45 13.02,4.45 | USB1.B7 13.22,5.28 13.02,5.08 13.02,4.45
  Top 0.61: R5.1 C5.2
  Bottom 1.778: J5.P20 J1.P20
DP  (via drill 0.5)
  Top 0.305: R4.1 13.33,9.84 13.72,9.46 USB1.A6 v13.72,4.76 | USB1.B6 14.72,5.76 15.24,5.24 v15.24,4.76
  Top 0.61: C4.2 R4.1
  Bottom 0.305: J2.P20 24.13,1.91 23.65,1.43 23.02,1.43 19.69,4.76 v15.24,4.76 14.76,4.76 14.21,4.21 13.89,4.21 13.72,4.38 v13.72,4.76
  Bottom 1.778: J6.P20 J2.P20
DTR  (via drill 0.5)
  Top 0.254: Q1.E 20.01,19.68 20,19.68 | 20.01,20 20.01,19.84 15.4,19.84 14.61,20.64 v14.29,20.64 | U2.28 10.09,13.74 10,13.65 v9.53,13.65
  Top 0.61: R13.1 | Q1.E 20.01,19.84 20.01,20 R13.1
  Bottom 0.406: v9.53,13.65 11.11,15.24 11.11,16.51 10.48,17.14 10.48,17.46 11.11,18.1 11.11,18.73 12.22,19.84 13.49,19.84 v14.29,20.64
EN  (via drill 0.5)
  Top 0.406: Q2.C 18.37,24.5 17.78,25.08 16.19,25.08 14.29,23.18 v9.21,23.18 | R1.1 C1.2 | C1.2 5.71,6.51 5.59,6.39 SW1.3 5.59,4.48 4.76,3.65 v4.76,3.33 | C1.2 5.05,7.17 4.76,7.46 v4.76,7.62 | SW1.4 6.42,1.34 v6.67,1.59
  Top 0.61: U1.3 v6.98,41.77
  Bottom 0.406: J1.P2 2.54,47.31 4.13,45.72 4.13,44.13 6.49,41.77 v6.98,41.77 7.44,41.77 7.62,41.59 7.94,41.27 7.94,34.61 10.79,31.75 10.79,25.72 9.21,24.13 v9.21,23.18 8.89,23.18 8.57,22.86 8.57,21.91 7.94,21.27 7.94,19.68 7.3,19.05 7.3,14.29 5.4,12.38 5.4,10.79 4.76,10.16 v4.76,7.62 | v4.76,3.33 4.76,3.65 5.24,4.13 6.19,4.13 7.3,3.02 7.46,2.86 7.46,1.91 7.14,1.59 v6.67,1.59
  Bottom 1.778: J1.P2 J5.P2
GND  (via drill 0.5)
  Top 0.254: U2.3 13.47,15.24 U2.29
  Top 0.305: 23.81,44.45 23.81,48.58 v24.13,48.9 23.81,49.21 23.81,50.16 | 23.81,44.45 23.81,44.13 v24.13,43.81 23.81,43.5 23.81,41.59 v24.13,41.27 23.81,40.96 23.81,39.05 v24.13,38.73 23.81,38.42 23.81,36.51 v24.13,36.2 23.81,35.88 23.81,33.97 v24.13,33.66 23.81,33.34 23.81,31.43 v24.13,31.11 23.81,30.8 23.81,28.89 v24.13,28.57 23.81,28.26 23.81,26.35 v24.13,26.04 23.81,25.72 23.81,23.81 v24.13,23.5 23.81,23.18 23.81,21.27 v24.13,20.95 23.81,20.64 23.81,18.73 v24.13,18.41 | 23.81,44.31 23.81,44.45 | v3.81,31.11 4.13,31.43 4.13,33.34 v3.81,33.66 4.13,33.97 4.13,35.88 v3.81,36.2 4.13,36.51 4.13,38.42 v3.81,38.73 4.13,39.05 4.13,40.96 v3.81,41.27 4.13,41.59 4.13,44.13 4.31,44.31 U1.1 | 23.81,50.16 23.81,51.12 v24.13,51.44 | 24.45,50.16 23.81,50.16 | v24.13,18.41 23.81,18.1 | v24.13,10.79 23.81,10.48 23.81,8.89 | 23.81,8.89 23.81,8.57 v24.13,8.26 23.81,7.94 23.81,6.03 v24.13,5.71 23.81,5.4 23.81,3.49 v24.13,3.17 23.81,2.86 23.81,0.95 v24.13,0.64 | 23.81,11.11 v24.13,10.79 | 23.81,11.11 23.81,12.7 24.13,13.02 v24.13,13.34 24.13,13.65 23.81,13.97 23.81,14.61 | 23.81,11.11 v24.13,10.79 | 23.81,18.1 v24.13,18.41 | 23.81,14.61 23.81,15.24 24.13,15.56 v24.13,15.88 24.13,16.19 23.81,16.51 23.81,16.67 23.81,16.83 | R9.1 23.81,14.74 23.81,14.61 | 23.81,18.1 23.81,16.83 | C2.1 22.23,8.57 22.54,8.89 23.81,8.89 | 4.13,21.91 4.13,23.5 | 4.13,30.8 v3.81,31.11 | C12.1 4.13,21.91 | 4.13,23.5 C13.1 6.54,24 6.75,24.21 U3.1 | 4.13,23.5 4.13,30.8 | 4.13,30.8 v3.81,31.11 | U1.40 23.81,44.31 | 23.81,44.31 23.81,44.45 | v20,33.02 16.51,33.02 16.19,33.34 v14.29,33.34 | U1.1.4 U1.1.5 | U1.1.5 U1.1.6
  Top 0.305: U1.1.6 U1.1.5 | U1.1.18 U1.1.6 | v12.38,33.34 v7.94,33.34 | 23.81,16.83 21.75,16.83 20.16,15.24 20.16,13.97 | 20.16,13.97 20.16,12.86 | 20.16,12.86 20.16,11.75 | C8.1 20.16,12.86 | R10.1 20.16,13.97 | 4.13,18.1 4.13,16.19 v3.81,15.88 4.13,15.56 4.13,14.29 | 4.13,18.1 4.13,21.91 | C10.1 10.98,17.65 12.06,18.73 v12.7,18.73 | 6.88,18.1 4.13,18.1 | R7.1 4.13,14.1 4.13,14.29 | 4.13,14.29 4.13,8.41 | 4.13,8.41 4.13,8.26 3.97,8.1 3.97,5.87 v3.81,5.71 3.97,5.56 3.97,3.33 v3.81,3.17 | C1.1 5.58,8.07 5.24,8.41 4.13,8.41
  Top 0.406: 19.69,11.75 TZ1.1 | SW2.2 20.2,2.86 | 20.2,2.86 SW2.1 | USB1.S4 18.31,2.86 20.2,2.86 | C10.1 10.16,17.14 9.58,16.56 | C11.1 18.73,23.18 19.05,23.5 v24.13,23.5 | 9.68,11.56 C3.1 9.68,11.72 v9.68,12.7 | v14.92,14.29 13.47,14.29 13.47,15.24 12.86,15.24 12.86,15.72 13.02,15.72 v13.02,16.19 | SW1.1 7.74,4.25 v7.46,3.97
  Top 0.61: C5.1 R6.1 C6.1 19.02,11.56 19.21,11.75 | 19.21,11.75 19.69,11.75 | C7.1 20.35,11.56 20.16,11.75 19.21,11.75 | C3.1 R3.1 C4.1 | USB1.A1B12 10.07,8.01 9.65,7.59 USB1.S1 9.65,6.47 8.82,5.64 SW1.1 | USB1.S4 USB1.S2 18.29,7.59 17.87,8.01 USB1.B1A12 | USB1.S3 9.65,1.71 9.28,1.34 SW1.2 | U1.1 6.53,44.31 6.67,44.45 v7.62,44.45 | U1.40 21.73,44.31 21.59,44.45 v20.96,44.45 | 9.58,16.56 C9.1 8.04,16.56 7.62,16.99 7.62,17.36 6.88,18.1 | U3.1 v14.13,24.21
  Top 0.813: J2.P1 24.45,50.16 | U1.1.11 12.47,38.97 12.38,39.05 v12.38,39.69 | U1.1.11 U1.1.1 U1.1.4 | U1.1.11 U1.1.3 U1.1.6 | U1.1.6 U1.1.18 11.11,35.19 11.11,35.24 | U1.1.4 U1.1.7 | U1.1.4 U1.1.5 | U1.1.5 U1.1.6 | U1.1.11 U1.1.5 | U1.1.5 U1.1.8 12.47,34.06 12.38,33.97 v12.38,33.34
  Bottom 0.305: v7.62,44.45 v8.57,44.45 v9.53,44.45 v10.48,44.45 v11.43,44.45 v12.38,44.45 v13.33,44.45 | v13.33,44.45 v14.29,44.45 v15.24,44.45 v16.19,44.45 v17.15,44.45 v18.1,44.45 v19.05,44.45 v20,44.45 v20.96,44.45 | v13.33,41.59 v13.33,40.64 | v13.33,42.55 v13.33,41.59 | v13.33,42.55 v13.33,43.5 | v13.33,43.5 v13.33,44.45 | v13.33,43.5 v12.38,43.5 CB2.1 | v13.33,43.5 v14.29,43.5 v15.24,43.5 v16.19,43.5 v17.15,43.5 v18.1,43.5 v19.05,43.5 v20,43.5 | CB1.1 13.33,41.91 v13.33,41.59 | v13.33,40.64 v12.38,40.64 v11.43,40.64 v10.48,40.64 | v13.33,40.64 v14.29,40.64 v15.24,40.64 v16.19,40.64 v17.15,40.64 v18.1,40.64 | v13.33,41.59 v14.29,41.59 v15.24,41.59 v16.19,41.59 v17.15,41.59 v18.1,41.59 v19.05,41.59 | v13.33,42.55 v14.29,42.55 v15.24,42.55 v16.19,42.55 v17.15,42.55 v18.1,42.55 v19.05,42.55 v20,42.55 | 8.57,2.13 8.57,1.27 8.89,1.27 | 8.89,1.27 v10.48,1.27 v11.43,1.27 v12.38,1.27 | v12.38,1.27 v13.33,1.27 | v13.33,1.27 v14.61,1.27 | v14.61,1.27 v15.56,1.27 | v15.56,1.27 v16.51,1.27 v17.46,1.27 19.27,1.27 JB1.G1 | v12.38,1.27 v12.38,2.22 v12.38,3.17 | v13.33,1.27 v13.33,2.22 v13.33,3.17 | v14.61,1.27 v14.61,2.22 v14.61,3.17 | v15.56,1.27 v15.56,2.22 v15.56,3.17 | v16.19,39.69 v16.19,38.73 v16.19,37.78 v16.19,36.83 v16.19,35.88 v16.19,34.92 | v20,33.02 v20,32.07 | v20,32.07 v20,31.11 | v20,32.07 v19.05,32.07 v19.05,31.11 | v19.05,31.11 v19.05,30.16 | v18.1,31.11 v19.05,31.11 | U1.1.5 U1.1.6 U1.1.18 | v13.33,33.34 v14.29,33.34 | v7.94,32.38 v7.94,33.34 | v12.38,33.34 v13.33,33.34 | v13.33,32.38 v13.33,33.34 | v13.33,39.69 v12.38,39.69 v11.43,39.69 v10.48,39.69 | v13.33,39.69 v13.33,40.64 | v13.33,39.69 v14.29,39.69 v15.24,39.69
  Bottom 0.305: v16.19,39.69 v15.24,39.69 | v17.15,39.69 v16.19,39.69 | v15.24,39.69 v15.24,38.73 v15.24,37.78 v15.24,36.83 v15.24,35.88 v15.24,34.92 v15.24,33.97 | v3.81,0.64 8.89,0.64 8.89,1.27
  Bottom 0.406: v24.13,0.64 22.86,0.64 21.26,2.23 JB1.G1 | 8.57,2.83 8.57,3.34 7.94,3.97 v7.46,3.97 | v9.68,12.7 9.84,12.7 13.02,15.88 v13.02,16.19 13.02,17.78 12.7,18.1 v12.7,18.73
  Bottom 0.61: 18.29,7.59 USB1.S2 19.27,7.01 JB1.G3 19.05,7.53 19.05,8.57 16.97,8.57 16.97,8.91 | 8.57,2.83 USB1.S3 9.65,2.23 JB1.G2 8.57,2.13 | JB1.G1 19.27,2.83 USB1.S4 | JB1.G4 9.65,7.53 USB1.S1
  Bottom 0.813: U1.1.8 12.47,34.06 12.38,33.97 v12.38,33.34 | U1.1.8 U1.1.18 U1.1.6 | U1.1.8 U1.1.7 U1.1.4 | U1.1.4 U1.1.1 U1.1.11 | U1.1.11 U1.1.3 U1.1.6 | U1.1.8 U1.1.5 | U1.1.5 U1.1.11 | U1.1.4 U1.1.5 | U1.1.5 U1.1.6
  Bottom 1.016: JB1.1 16.97,8.91
  Bottom 1.778: J6.P1 J2.P1
  pour Top: 0,0 27.94,0 27.94,52.07 24.13,52.07 24.13,44.77 3.81,44.77 3.81,52.07 0,52.07
  pour Bottom: 0,0 27.94,0 27.94,52.07 24.13,52.07 24.13,44.77 3.81,44.77 3.81,52.07 0,52.07
  pour Route15: 0,0 27.94,0 27.94,52.07 24.13,52.07 24.13,44.77 3.81,44.77 3.81,52.07 0,52.07
IO0  (via drill 0.5)
  Top 0.406: R2.1 v21.27,7.17 | v21.27,7.17 21.27,6.03 21.66,5.64 SW2.4 SW2.3 | C2.2 v21.27,7.17 | Q1.C 20.91,17.41 Q1.C | Q1.C 22.81,17.41 23.18,17.78 v23.18,18.41 | v18.89,18.1 20.27,18.1 Q1.C
  Top 0.61: U1.27 20.93,27.8 20,28.73 v20,29.53
  Bottom 0.406: J2.P14 24.13,17.14 23.18,18.1 v23.18,18.41 23.18,19.68 22.54,20.32 22.54,21.91 21.91,22.54 21.91,24.13 21.27,24.77 21.27,26.35 20,27.62 v20,29.53 | v21.27,7.17 21.27,10.79 19.69,12.38 19.69,15.88 18.89,16.67 v18.89,18.1
  Bottom 1.778: J6.P14 J2.P14
IO1  (via drill 0.5)
  Top 0.61: U1.39 v20.96,43.04
  Bottom 0.406: J2.P2 25.4,47.31 22.54,44.45 22.54,43.18 21.91,42.55 21.27,42.55 20.96,42.86 v20.96,43.04
  Bottom 1.778: J6.P2 J2.P2
IO2  (via drill 0.5)
  Top 0.61: U1.38 v20.96,41.77 20.5,41.77 19.69,40.96 v19.69,39.69
  Bottom 0.406: v20.96,41.77 22.33,41.77 23.18,42.62 23.18,44.13 24.13,45.09 J2.P3 | JB1.4 10.97,11.61 15.08,15.72 15.08,18.41 16.51,19.84 16.51,21.43 15.08,22.86 15.08,25.88 13.97,26.99 13.97,29.53 19.37,34.92 19.37,39.37 v19.69,39.69
  Bottom 1.778: J6.P3 J2.P3
IO3  (via drill 0.5)
  Top 0.61: U1.15 v6.98,27.94
  Bottom 0.406: v6.98,27.94 6.98,26.67 5.4,25.08 5.4,23.5 4.76,22.86 4.76,21.27 4.13,20.64 4.13,19.05 2.54,17.46 J1.P14
  Bottom 1.778: J5.P14 J1.P14
IO4  (via drill 0.5)
  Top 0.61: U1.4 v6.98,40.5
  Bottom 0.406: J1.P3 2.54,44.77 6.8,40.5 v6.98,40.5
  Bottom 1.778: J1.P3 J5.P3
IO5  (via drill 0.5)
  Top 0.61: U1.5 v6.67,39.23
  Bottom 0.406: J1.P4 3.81,42.55 6.03,40.32 6.03,39.69 6.49,39.23 v6.67,39.23
  Bottom 1.778: J1.P4 J5.P4
IO6  (via drill 0.5)
  Top 0.61: U1.6 v6.67,37.96
  Bottom 0.406: v6.67,37.96 5.85,37.96 3.81,40.01 J1.P5
  Bottom 1.778: J1.P5 J5.P5
IO7  (via drill 0.5)
  Top 0.61: U1.7 v6.67,36.69
  Bottom 0.406: v6.67,36.69 4.58,36.69 3.81,37.47 J1.P6
  Bottom 1.778: J1.P6 J5.P6
IO8  (via drill 0.5)
  Top 0.61: U1.12 v6.67,30.34
  Bottom 0.406: v6.67,30.34 6.21,30.34 4.13,28.26 4.13,26.67 2.54,25.08 J1.P11
  Bottom 1.778: J5.P11 J1.P11
IO9  (via drill 0.5)
  Top 0.61: U1.17 9.53,27.62 8.57,28.57 v7.94,28.57
  Bottom 0.406: J1.P15 3.81,14.61 4.76,15.56 4.76,20.32 5.4,20.95 5.4,22.54 6.03,23.18 6.03,24.77 8.26,26.99 8.26,28.26 v7.94,28.57
  Bottom 1.778: J5.P15 J1.P15
IO10  (via drill 0.5)
  Top 0.61: U1.18 10.79,27.62 8.89,29.53 v8.26,29.53
  Bottom 0.406: v8.26,29.53 8.89,28.89 8.89,26.67 6.67,24.45 6.67,22.86 6.03,22.23 6.03,20.64 5.4,20 5.4,15.24 2.54,12.38 J1.P16
  Bottom 1.778: J5.P16 J1.P16
IO11  (via drill 0.5)
  Top 0.61: U1.19 12.06,27.62 9.21,30.48 v8.57,30.48
  Bottom 0.406: v8.57,30.48 9.21,30.48 9.53,30.16 9.53,26.35 7.3,24.13 7.3,22.54 6.67,21.91 6.67,20.32 6.03,19.68 6.03,14.92 4.13,13.02 4.13,11.43 2.54,9.84 J1.P17
  Bottom 1.778: J5.P17 J1.P17
IO12  (via drill 0.5)
  Top 0.61: U1.20 13.33,27.62 9.53,31.43 v8.89,31.43
  Bottom 0.406: J1.P18 2.54,7.3 4.13,8.89 4.13,10.48 4.76,11.11 4.76,12.7 6.67,14.61 6.67,19.37 7.3,20 7.3,21.59 7.94,22.23 7.94,23.81 10.16,26.04 10.16,30.8 9.53,31.43 v8.89,31.43
  Bottom 1.778: J5.P18 J1.P18
IO13  (via drill 0.5)
  Top 0.61: U1.21 14.61,28.26 16.19,29.84 v16.67,29.84
  Bottom 0.406: J2.P19 24.13,4.45 23.18,5.4 23.18,6.99 22.54,7.62 22.54,9.21 21.91,9.84 21.91,11.11 20.32,12.7 20.32,16.19 19.69,16.83 19.69,18.41 19.37,18.73 19.37,20.32 18.73,20.95 18.73,22.54 18.1,23.18 18.1,24.77 15.24,27.62 15.24,28.89 16.19,29.84 v16.67,29.84
  Bottom 1.778: J6.P19 J2.P19
IO14  (via drill 0.5)
  Top 0.61: U1.22 15.88,27.94 v16.19,28.26
  Bottom 0.406: J2.P18 24.13,6.99 23.18,7.94 23.18,9.53 22.54,10.16 22.54,11.43 20.96,13.02 20.96,16.51 20.32,17.14 20.32,18.73 20,19.05 20,20.64 19.37,21.27 19.37,22.86 18.73,23.5 18.73,25.08 16.19,27.62 v16.19,28.26
  Bottom 1.778: J6.P18 J2.P18
IO15  (via drill 0.5)
  Top 0.61: U1.8 v6.67,35.42
  Bottom 0.406: v6.67,35.42 4.31,35.42 3.81,34.92 J1.P7
  Bottom 1.778: J1.P7 J5.P7
IO16  (via drill 0.5)
  Top 0.61: U1.9 v6.67,34.15
  Bottom 0.406: v6.67,34.15 5.58,34.15 3.81,32.38 J1.P8
  Bottom 1.778: J1.P8 J5.P8
IO17  (via drill 0.5)
  Top 0.61: U1.10 v6.67,32.88
  Bottom 0.406: v6.67,32.88 6.67,32.7 3.81,29.84 J1.P9
  Bottom 1.778: J1.P9 J5.P9
IO18  (via drill 0.5)
  Top 0.61: U1.11 v6.98,31.61
  Bottom 0.406: v6.98,31.61 6.53,31.61 2.54,27.62 J1.P10
  Bottom 1.778: J5.P10 J1.P10
IO19  (via drill 0.5)
  Top 0.61: U1.13 v6.51,29.07
  Bottom 0.406: v6.51,29.07 5.89,29.07 4.76,27.94 4.76,26.35 4.13,25.72 4.13,24.13 2.54,22.54 J1.P12
  Bottom 1.778: J5.P12 J1.P12
IO20  (via drill 0.5)
  Top 0.61: U1.14 5.22,27.16 v5.71,26.67
  Bottom 0.406: v5.71,26.67 5.71,26.35 4.76,25.4 4.76,23.81 4.13,23.18 4.13,21.59 2.54,20 J1.P13
  Bottom 1.778: J5.P13 J1.P13
IO21  (via drill 0.5)
  Top 0.61: U1.23 v17.15,28.89
  Bottom 0.406: J2.P17 24.13,9.53 23.18,10.48 23.18,11.75 21.59,13.34 21.59,16.83 20.96,17.46 20.96,19.05 20.64,19.37 20.64,20.95 20,21.59 20,23.18 19.37,23.81 19.37,25.4 17.15,27.62 v17.15,28.89
  Bottom 1.778: J6.P17 J2.P17
IO35  (via drill 0.5)
  Top 0.61: U1.28 v20.96,29.07
  Bottom 0.406: J2.P13 24.13,19.68 23.18,20.64 23.18,22.23 22.54,22.86 22.54,24.45 21.91,25.08 21.91,26.67 20.96,27.62 v20.96,29.07
  Bottom 1.778: J6.P13 J2.P13
IO36  (via drill 0.5)
  Top 0.61: U1.29 v20.64,30.34
  Bottom 0.406: J2.P12 24.13,22.23 23.18,23.18 23.18,24.77 22.54,25.4 22.54,26.99 21.91,27.62 21.91,29.21 20.78,30.34 v20.64,30.34
  Bottom 1.778: J6.P12 J2.P12
IO37  (via drill 0.5)
  Top 0.61: U1.30 v20.96,31.61
  Bottom 0.406: J2.P11 24.13,24.77 23.18,25.72 23.18,27.3 22.54,27.94 22.54,29.53 21.91,30.16 21.91,31.11 21.41,31.61 v20.96,31.61
  Bottom 1.778: J6.P11 J2.P11
IO38  (via drill 0.5)
  Top 0.61: U1.31 v20.96,32.88
  Bottom 0.406: J2.P10 24.13,27.3 23.18,28.26 23.18,29.84 22.54,30.48 22.54,32.07 21.73,32.88 v20.96,32.88
  Bottom 1.778: J6.P10 J2.P10
IO39  (via drill 0.5)
  Top 0.61: U1.32 v20.96,34.15
  Bottom 0.406: J2.P9 24.13,29.84 23.18,30.8 23.18,32.38 21.41,34.15 v20.96,34.15
  Bottom 1.778: J6.P9 J2.P9
IO40  (via drill 0.5)
  Top 0.61: U1.33 v20.96,35.42
  Bottom 0.406: J2.P8 24.13,32.38 21.09,35.42 v20.96,35.42
  Bottom 1.778: J6.P8 J2.P8
IO41  (via drill 0.5)
  Top 0.61: U1.34 v20.96,36.69
  Bottom 0.406: v20.96,36.69 21.09,36.69 22.86,34.92 J2.P7
  Bottom 1.778: J6.P7 J2.P7
IO42  (via drill 0.5)
  Top 0.61: U1.35 v20.96,37.96
  Bottom 0.406: J2.P6 24.13,37.47 23.5,38.1 22.58,38.1 22.38,37.9 22.38,36.99 22.23,36.83 21.91,36.83 21.75,36.99 21.75,37.78 21.57,37.96 v20.96,37.96 20.5,37.96 20,37.47 20,34.61 19.69,34.29 19.69,33.97 19.53,33.81 19.21,33.81 19.05,33.66 19.05,33.34 18.89,33.18 18.57,33.18 18.42,33.02 18.42,32.7 18.26,32.54 17.94,32.54 17.78,32.38 17.78,32.07 17.62,31.91 17.3,31.91 17.15,31.75 17.15,31.43 16.99,31.27 16.67,31.27 16.51,31.11 16.51,30.8 16.35,30.64 16.03,30.64 14.61,29.21 14.61,27.3 15.72,26.19 15.72,25.88 15.88,25.72 16.19,25.72 16.35,25.56 16.35,25.24 16.19,25.08 15.88,25.08 15.72,24.92 15.72,23.18 17.15,21.75 17.15,19.53 15.72,18.1 15.72,12.22 15.56,12.06 15.24,12.06 15.08,12.22 14.29,12.22 14.13,12.06 13.81,12.06 13.65,12.22 13.65,12.54 13.49,12.7 13.18,12.7 12.97,12.49 JB1.3
  Bottom 1.778: J6.P6 J2.P6
IO45
  Top 0.406: U1.26 22.03,26.55 22.86,25.72 J4.P$1
IO46
  Top 0.406: U1.16 8.26,25.4 7.62,24.77 J3.P$1
IO47  (via drill 0.5)
  Top 0.406: v23.18,13.34 22.73,13.34 R9.2
  Top 0.61: U1.24 18.42,27.62 18.1,27.94 v18.1,29.53
  Bottom 0.406: v18.1,29.53 18.1,27.62 20,25.72 20,24.13 20.64,23.5 20.64,21.91 21.27,21.27 21.27,19.68 21.59,19.37 21.59,17.78 22.23,17.14 22.23,13.65 22.54,13.34 v23.18,13.34 23.18,13.02 24.13,12.06 J2.P16
  Bottom 1.778: J6.P16 J2.P16
IO48  (via drill 0.5)
  Top 0.406: v23.18,15.88 21.59,15.88 20.96,15.24 R8.1
  Top 0.61: U1.25 19.69,27.62 19.05,28.26 v19.05,28.89
  Bottom 0.406: 23.18,16.51 23.18,17.14 22.23,18.1 22.23,19.68 21.91,20 21.91,21.59 21.27,22.23 21.27,23.81 20.64,24.45 20.64,26.04 19.05,27.62 v19.05,28.89 | 23.18,16.51 v23.18,15.88 | v23.18,15.88 23.18,16.51 | v23.18,15.88 23.18,15.56 24.13,14.61 J2.P15
  Bottom 1.778: J6.P15 J2.P15
N$1
  Top 0.254: U2.5 14.47,12.2 14.61,12.06 R5.2
N$2
  Top 0.254: U2.4 13.97,12.2 R4.2
N$3
  Top 0.61: C10.2 10.16,19.61
  Top 0.813: 8.57,18.73 C9.2
  Top 1.016: U3.3 10.16,19.61 8.57,19.61 | 8.57,19.61 F1.2 | 8.57,19.61 8.57,18.73
N$4
  Top 0.61: LED1.1 R7.2
N$5
  Top 0.61: LED2.1 22.11,11.86 20.96,13.02 R8.2
N$6
  Top 0.61: R13.2 Q2.B
N$7
  Top 0.61: R14.2 Q1.B
N$8
  Top 0.254: U2.9 16.94,14.24 17.22,14.53 17.22,15.64 18.1,16.51 R12.2
N$10
  Top 0.254: U2.8 17.07,13.74 17.3,13.97 R10.2
  Top 0.305: R10.2 18.6,14.39 18.81,14.61 19.29,14.61 19.5,14.82 R11.2
RTS  (via drill 0.5)
  Top 0.254: R14.1 21.41,21.41 20.96,20.95 20.96,19.21 20.48,18.73 19.53,18.73 18.89,19.37 15.24,19.37 14.76,19.84 13.97,19.84 v13.18,20.64 | U2.24 10.61,15.74 v10.32,16.03
  Top 0.61: R14.1 Q2.E
  Bottom 0.406: v13.18,20.64 12.06,20.64 10.48,19.05 10.48,18.41 9.84,17.78 9.84,16.51 v10.32,16.03
RXD  (via drill 0.5)
  Top 0.254: U2.26 10.45,14.74 10.16,14.45 v9.05,14.45
  Top 0.406: v17.86,38.26 19.51,38.26 20.48,39.23 v20.96,39.23
  Top 0.61: U1.36 v20.96,39.23
  Bottom 0.406: J2.P5 23.73,40.01 23.18,39.45 23.18,39.05 23.02,38.89 22.25,38.89 21.91,39.23 v20.96,39.23 | v9.05,14.45 8.57,14.92 8.57,18.41 9.21,19.05 9.21,19.68 11.43,21.91 11.43,23.5 12.7,24.77 12.7,30.16 17.86,35.32 v17.86,38.26
  Bottom 1.778: J6.P5 J2.P5
TXD  (via drill 0.5)
  Top 0.254: U2.25 v9.68,15.24
  Top 0.61: U1.37 v20.96,40.5
  Bottom 0.406: J2.P4 24.13,42.55 22.09,40.5 v20.96,40.5 19.07,40.5 18.73,40.16 18.73,35.24 13.33,29.84 13.33,24.45 12.06,23.18 12.06,22.7 12.22,22.54 12.38,22.54 12.54,22.38 12.54,21.75 12.38,21.59 12.06,21.59 9.84,19.37 9.84,18.73 9.21,18.1 9.21,15.72 v9.68,15.24
  Bottom 1.778: J6.P4 J2.P4
V_USB  (via drill 0.5, 0.6, 0.8)
  Top 0.406: R11.1 v17.94,15.24
  Top 0.61: USB1.B4A9 16.42,8.8 16.83,9.21 17.78,9.21 v18.42,9.84 C6.2 | USB1.A4B9 11.52,8.8 11.11,9.21 10.79,9.21 10.16,9.84 v9.53,9.84 C3.2 | 7.3,9.84 D1.2 | v14.13,18.89 14.76,18.89 14.92,18.73 16.35,18.73 16.67,18.41 v16.67,17.78 | v5.87,3.17 5.87,3.65 6.83,4.6 v6.83,6.35
  Top 0.813: D1.2 9.53,9.87 v9.53,9.84
  Bottom 0.61: v18.42,9.84 18.42,11.27 17.78,11.91 16.99,11.91 16.51,12.38 16.51,13.65 16.99,14.13 17.62,14.13 17.94,14.45 v17.94,15.24 16.67,16.51 v16.67,17.78 | v14.13,18.89 14.13,15.88 9.53,11.27 v9.53,9.84 8.1,9.84 7.46,9.21 7.46,7.14 6.83,6.51 v6.83,6.35 | v5.87,3.17 5.87,2.7 JB2.P$1

### Text on the board
tNames: LAMLOEI | NODE32S3 | CP2102 | 46 | 45 | 19 | 20 | 36 | 35 | 3 | 0 | 9 | 48 | 47 | 11 | P | 48 | 21 | 12 | 5V | 14 | 13 | D- | D+ | E | B
bNames: 3V3 | EN | GND | 1 | 4 | 2 | 5 | 43TXD | 6 | 44RXD | 7 | 42 | 15 | 41 | 16 | 17 | 40 | 39 | 18 | 8 | 38 | 37 | 19 | 20 | 36 | 35 | 3 | NODE32S3 | LAMLOEI | 9 | 0 | 48 | 10 | SCL | SDA | 5V | GND | 47 | 11 | 21 | 12 | 14 | 5V | D | 13 | D+
tDocu: U1 | ESP32-S3-WROOM | J5 | J1 | J3 | J4 | J2 | J6 | C13 | 100n | Q2 | C12 | U3 | C11 | 22u | LM1117MPX | 100n | R13 | R14 | 12K | 12K | C9 | C10 | Q1 | F1 | 100n | 22u | R12 | 12K | CP2102 | U2 | R11 | 24K | R8 | R9 | R7 | R10 | 47K | 2K2 | 12K | 2K2 | C8 | LED1 | TZ1 | 100n | LED2 | D1 | C3 | R3 | C4 | R4 | R5 | C5 | R6 | C6 | C7 | BLU | 100n | 5K1 | 47p | 27 | 27 | 47p | 5K1 | 100n | 100n | YEL | C1 | R1 | R2 | C2 | 1u | 12K | 12K | 100n | USB1 | SW1 | SW2
bDocu: 100n | CB2 | 22u | CB1 | JB1